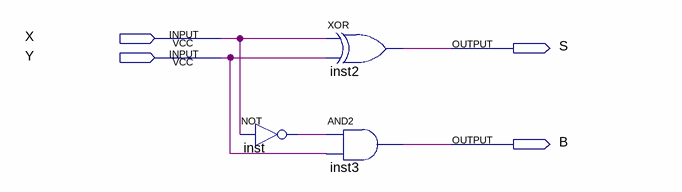
[diagram p0: schematic sheet]
// Quartus schematic Meio_Subtrador.bdf as structural Verilog: 3 symbols, 4 pins
module Meio_Subtrador (
  input  X,
  input  Y,
  output S,
  output B
);

  wire inst_out;

  not inst (inst_out, X);
  xor inst2 (S, X, Y);
  and inst3 (B, inst_out, Y);
endmodule
